# Altium schematic sheet DAC_and_amp.SchDoc
size A4; SheetNumber: 3; SheetTotal: 4
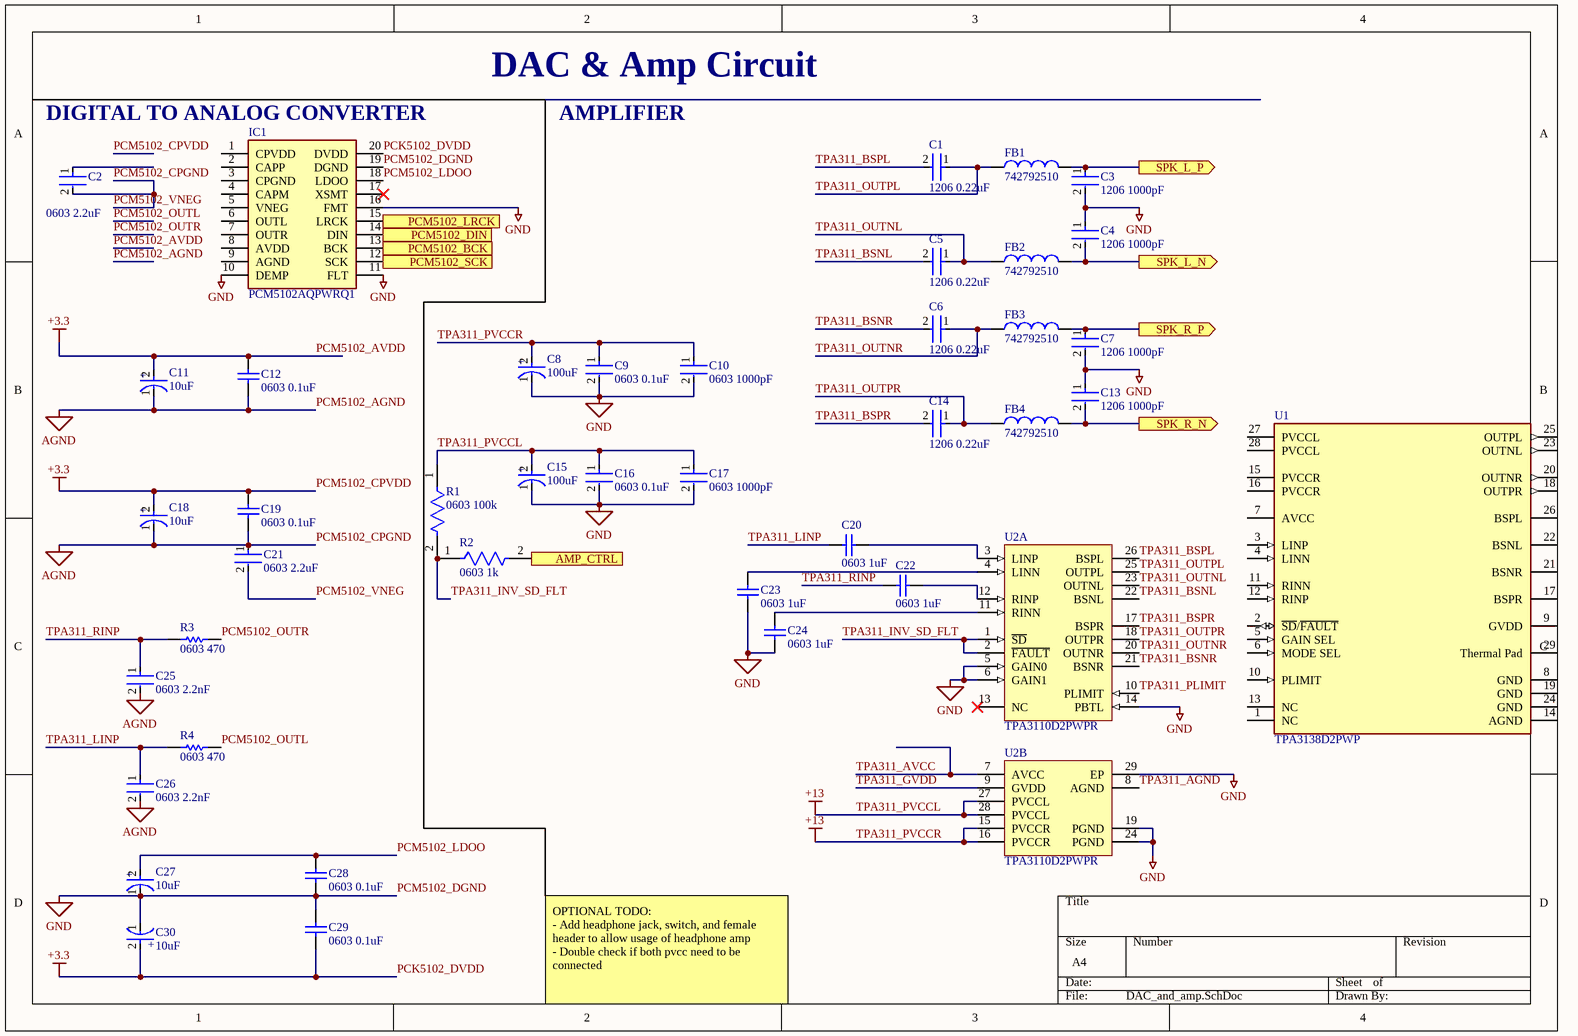
[diagram p0: DAC_and_amp.SchDoc]

## Parts
C1  1206 0.22uF  [FP-C1206C-EB-MFG]
C2  0603 2.2uF  [FP-GRM188-0_1-e0_2_0_5-MFG]
C3  1206 1000pF  [FP-C1206C-EB-MFG]
C4  1206 1000pF  [FP-C1206C-EB-MFG]
C5  1206 0.22uF  [FP-C1206C-EB-MFG]
C6  1206 0.22uF  [FP-C1206C-EB-MFG]
C7  1206 1000pF  [FP-C1206C-EB-MFG]
C8  100uF  [FP-RAD-TH-D_8_0_5-L_11_5-MFG]
C9  0603 0.1uF  [FP-C0603C-CF-MFG]
C10  0603 1000pF  [FP-C0603C-CF-MFG]
C11  10uF  [FP-35ZLH330MEFC10X12_5-MFG]
C12  0603 0.1uF  [CAPC1608X90X35ML10T15]
C13  1206 1000pF  [FP-C1206C-EB-MFG]
C14  1206 0.22uF  [FP-C1206C-EB-MFG]
C15  100uF  [FP-RAD-TH-D_8_0_5-L_11_5-MFG]
C16  0603 0.1uF  [FP-C0603C-CF-MFG]
C17  0603 1000pF  [FP-C0603C-CF-MFG]
C18  10uF  [FP-35ZLH330MEFC10X12_5-MFG]
C19  0603 0.1uF  [CAPC1608X90X35ML10T15]
C20  0603 1uF  [CAPC1608X87X35LL15T15]
C21  0603 2.2uF  [FP-GRM188-0_1-e0_2_0_5-MFG]
C22  0603 1uF  [CAPC1608X87X35LL15T15]
C23  0603 1uF  [CAPC1608X87X35LL15T15]
C24  0603 1uF  [CAPC1608X87X35LL15T15]
C25  0603 2.2nF  [FP-GRM188-0_1-e0_2_0_5-MFG]
C26  0603 2.2nF  [FP-GRM188-0_1-e0_2_0_5-MFG]
C27  10uF  [FP-35ZLH330MEFC10X12_5-MFG]
C28  0603 0.1uF  [CAPC1608X90X35ML10T15]
C29  0603 0.1uF  [CAPC1608X90X35ML10T15]
C30  10uF  [FP-35ZLH330MEFC10X12_5-MFG]
FB1  742792510  [WE-CBF_1812_L4.5W3.2H1.5_HC]
FB2  742792510  [WE-CBF_1812_L4.5W3.2H1.5_HC]
FB3  742792510  [WE-CBF_1812_L4.5W3.2H1.5_HC]
FB4  742792510  [WE-CBF_1812_L4.5W3.2H1.5_HC]
IC1  PCM5102AQPWRQ1  [SOP65P640X120-20N]
R1  0603 100k  [FP-RC0603-0_55-MFG]
R2  0603 1k  [FP-AC0603-IPC_B]
R3  0603 470  [RESC1608X55X30NL15T15]
R4  0603 470  [RESC1608X55X30NL15T15]
U1  TPA3138D2PWP  [FP-PWP0028H-IPC_B]
U2  TPA3110D2PWPR  [TI-PWP28-5720X1950TP_L]  (parts A,B of 2)

## Ports
AMP_CTRL, PCM5102_BCK, PCM5102_DIN, PCM5102_LRCK, PCM5102_SCK, SPK_L_N (out), SPK_L_P (out), SPK_R_N (out), SPK_R_P (out)

## Nets
PCK5102_DVDD: C11.2(A) C12.2 C18.2(A) C19.2 C29.1 C30.2(A) IC1.20(DVDD)  [also labelled +3.3, PCM5102_AVDD, PCM5102_CPVDD]
PCM5102_AGND: C2.2 C11.1(C) C12.1 C18.1(C) C19.1 C21.1 C21.2 C25.2 C26.2  [also labelled AGND, PCM5102_CPGND, PCM5102_VNEG]
PCM5102_DGND: C3.2 C4.1 C7.2 C8.1(C) C9.2 C10.2 C13.1 C15.1(C) C16.2 C17.2 C23.1 C24.1 C27.1(C) C28.1 C29.2 C30.1(C) IC1.10(DEMP) IC1.11(FLT) IC1.16(FMT) IC1.19(DGND) U2.5(GAIN0) U2.6(GAIN1) U2.14(PBTL) U2.19(PGND) U2.24(PGND) U2.29(EP)  [also labelled GND]
TPA311_PVCCL: C8.2(A) C9.1 C10.1 C15.2(A) C16.1 C17.1 R1.1 U2.15(PVCCR) U2.16(PVCCR) U2.27(PVCCL) U2.28(PVCCL)  [also labelled +13, TPA311_PVCCR]
AMP_CTRL: R2.2 ; port AMP_CTRL
PCM5102_BCK: IC1.13(BCK) ; port PCM5102_BCK
PCM5102_DIN: IC1.14(DIN) ; port PCM5102_DIN
PCM5102_LDOO: C27.2(A) C28.2 IC1.18(LDOO)
PCM5102_LRCK: IC1.15(LRCK) ; port PCM5102_LRCK
PCM5102_OUTL: R4.2
PCM5102_OUTR: R3.2
PCM5102_SCK: IC1.12(SCK) ; port PCM5102_SCK
SPK_L_N: C4.2 FB2.2 ; port SPK_L_N
SPK_L_P: C3.1 FB1.2 ; port SPK_L_P
SPK_R_N: C13.2 FB4.2 ; port SPK_R_N
SPK_R_P: C7.1 FB3.2 ; port SPK_R_P
TPA311_AGND: U2.8(AGND)
TPA311_AVCC: U2.7(AVCC)
TPA311_BSNL: C5.2 U2.22(BSNL)
TPA311_BSNR: C6.2 U2.21(BSNR)
TPA311_BSPL: C1.2 U2.26(BSPL)
TPA311_BSPR: C14.2 U2.17(BSPR)
TPA311_GVDD: U2.9(GVDD)
TPA311_INV_SD_FLT: R1.2 R2.1 U2.1(~{SD}) U2.2(~{FAULT})
TPA311_LINP: C20.1 C26.1 R4.1
TPA311_OUTNL: C5.1 FB2.1 U2.23(OUTNL)
TPA311_OUTNR: C6.1 FB3.1 U2.20(OUTNR)
TPA311_OUTPL: C1.1 FB1.1 U2.25(OUTPL)
TPA311_OUTPR: C14.1 FB4.1 U2.18(OUTPR)
TPA311_PLIMIT: U2.10(PLIMIT)
TPA311_RINP: C22.1 C25.1 R3.1
NetC20_2: C20.2 U2.3(LINP)
NetC22_2: C22.2 U2.12(RINP)
NetC23_2: C23.2 U2.4(LINN)
NetC24_2: C24.2 U2.11(RINN)

Not connected (* = marked no-connect by the designer): C2 1; IC1 1(CPVDD) 2(CAPP) 3(CPGND) 4(CAPM) 5(VNEG) 6(OUTL) 7(OUTR) 8(AVDD) 9(AGND) 17(XSMT)*; U1 1(NC) 2(~{SD}/~{FAULT}) 3(LINP) 4(LINN) 5(GAIN_SEL) 6(MODE_SEL) 7(AVCC) 8(GND) 9(GVDD) 10(PLIMIT) 11(RINN) 12(RINP) 13(NC) 14(AGND) 15(PVCCR) 16(PVCCR) 17(BSPR) 18(OUTPR) 19(GND) 20(OUTNR) 21(BSNR) 22(BSNL) 23(OUTNL) 24(GND) 25(OUTPL) 26(BSPL) 27(PVCCL) 28(PVCCL) 29(Thermal_Pad); U2 13(NC)*

## Notes on the sheet
- DAC & Amp Circuit
- (near IC1) DIGITAL TO ANALOG CONVERTER
- AMPLIFIER
- OPTIONAL TODO:
  - Add headphone jack, switch, and female header to allow usage of headphone amp
  - Double check if both pvcc need to be connected
- (in symbol CMP-01474-19941892-1) +
- (in symbol CMP-05427-002079-1) +

## Library data of the parts
C1 C5 C6 C14 = CMP-03020-014280-1: CAP CER 0.22UF 50V X7R 1206; Manufacturer Part Number: C1206C224K5RACTU; Manufacturer: KEMET; Value: 0.22 μF; Automotive Grade: Grade 0; Tolerance: 0.1; Material: Ceramic; Temperature Coefficient: 15%; Octopart: https://octopart.com/c1206c224k5ractu-kemet-99129; Automotive: Yes; ComponentLink2URL: https://content.kemet.com/datasheets/KEM_C1007_X8R_ULTRA_150C_SMD.pdf; Ipc Land Pattern Name: CAPC320160X78; Digikey Description: CAP CER 0.22UF 50V X7R 1206; Voltage Rating: 50 V; RoHS: TRUE; Device Class L3: Ceramic Capacitors; Device Class L2: Capacitors; Device Class L1: Passive Components; Temperature Range Low: -55°C; Temperature: -55°C to +150°C; Temperature Range High: +150°C; ComponentLink2Description: Datasheet; Category: Cap; Height: 0.88mm; Capacitance: 0.22 μF; Temperature Characteristic: X7R; Package: C1206C-EB; Lead Free: Yes
C2 C21 = CMP-2006-02836-2: Chip Multilayer Ceramic Capacitors for General Purpose, 0603, 2.2uF, X7R, 15%, 10%, 10V; Case Code (Metric): 1608; Height: 0.8mm; Packaging: Cut Tape; Voltage: 10V; Lead Free: Lead Free; Min Operating Temperature: -55°C; Voltage Rating (DC): 10V; Max Operating Temperature: 125°C; Voltage Rating: 10V; Dielectric: X7R; Depth: 0.8mm; Case Code (Imperial): 0603; Termination: SMD/SMT; Case/Package: 0603; Number of Pins: 2; REACH SVHC: No SVHC; Mount: Surface Mount; Width: 0.031inch; Material: Ceramic; Capacitance: 2.2uF; Package Quantity: 1; Weight: 7.1E-05oz; Length: 1.6mm; Thickness: 0.035inch; Tolerance: 10%
C3 C4 C7 C13 = CMP-03020-011698-1: CAP CER 100PF 100V C0G/NP0 1206; Manufacturer: KEMET; Manufacturer Part Number: C1206C101J1GACTU; Temperature Characteristic: C0G; Temperature Coefficient: 15%; Tolerance: 0.05; Automotive Grade: Grade 0; Material: Ceramic; Temperature Range Low: -55°C; Device Class L3: Ceramic Capacitors; Temperature: -55°C to +150°C; Value: 100 pF; Capacitance: 100 pF; ComponentLink2URL: https://content.kemet.com/datasheets/KEM_C1007_X8R_ULTRA_150C_SMD.pdf; Ipc Land Pattern Name: CAPC320160X78; Mouser Description: Multilayer Ceramic Capacitors MLCC - SMD/SMT 100volts 100pF C0G 5%; Automotive: Yes; Voltage Rating: 100 V; Octopart: https://octopart.com/c1206c101j1gactu-kemet-98729; Height: 0.88mm; RoHS: TRUE; Lead Free: Yes; Device Class L1: Passive Components; Package: C1206C-EB; Digikey Description: CAP CER 100PF 100V C0G/NP0 1206; ComponentLink2Description: Datasheet; Temperature Range High: +150°C; Category: Cap; Device Class L2: Capacitors
C8 C15 = CMP-05427-002079-1: Aluminum Electrolytic Capacitors (Radial Lead Type) 100uF ±20% 50V; ESR (Equivalent Series Resistance): 61mR; Lead Diameter: 0.6mm; Ripple Current (AC): 870mA; Life (Hours): 6000Hour; Lead/Base Style: Straight; Height - Seated (Max): 0.512inch; Height: 11.5mm; REACH SVHC: No SVHC; Contact Plating: Tin; Impedance: 61mR; Capacitance: 100uF; Voltage: 50V; Termination: Radial; Series: FR; Voltage Rating: 50V; Lead Pitch: 3.5mm; Diameter: 8mm; Number of Pins: 2; Min Operating Temperature: -40°C; Mount: Through Hole; Ripple Current: 870mA; Radiation Hardening: No; Length: 11.5mm; Max Operating Temperature: 105°C; Construction: RADIAL; Packaging: Bulk; Package Quantity: 200; Case/Package: Radial; RoHS Compliant: Yes; Voltage Rating (DC): 50V; Tolerance: 20%
C9 C16 = CMP-2006-03057-2: CAP CER 0.1UF 25V X7R 0603; Manufacturer Part Number: C0603C104K3RACTU; Manufacturer: KEMET; Description: C0603 0.10 μF X7R 30ppm/°C 10.00% 25 V; Value: 0.10 μF; Material: Ceramic; Tolerance: 0.1; Temperature Coefficient: 30ppm/°C; Automotive Grade: Grade 1; Lead Free: Yes; Device Class L3: Ceramic Capacitors; Voltage Rating: 25 V; Digikey Description: CAP CER 0.1UF 25V X7R 0603; Mouser Description: Multilayer Ceramic Capacitors MLCC - SMD/SMT 25volts 0.1uF X7R 10%; Package: C0603C-CF; Temperature Range Low: -55°C; Automotive: Yes; Device Class L2: Capacitors; Octopart: https://octopart.com/c0603c104k3ractu-kemet-127541; ComponentLink2Description: Datasheet; ComponentLink2URL: https://api.kemet.com/component-edge/download/datasheet/C0603C100J5GACAUTO.pdf; Temperature Range High: +125°C; RoHS: TRUE; Device Class L1: Passive Components; Category: Cap; Temperature: -55°C to +125°C; Capacitance: 0.10 μF; Height: 0.87mm; Temperature Characteristic: X7R
C10 C17 = CMP-2006-03010-2: CAP CER 1000PF 25V 5% NP0 0603; Manufacturer: KEMET; Manufacturer Part Number: C0603C102J3GACTU; Value: 1,000 pF; Description: C0603 1,000 pF C0G 30ppm/°C 5.00% 25 V; Tolerance: 0.05; Temperature Characteristic: C0G; Temperature Coefficient: 30ppm/°C; Automotive Grade: Grade 1; Material: Ceramic; Category: Cap; Device Class L2: Capacitors; Octopart: https://octopart.com/c0603c102j3gactu-kemet-8375722; Capacitance: 1,000 pF; ComponentLink2URL: https://api.kemet.com/component-edge/download/datasheet/C0603C100J5GACAUTO.pdf; Digikey Description: CAP CER 1000PF 25V 5% NP0 0603; Device Class L3: Ceramic Capacitors; Temperature Range Low: -55°C; Automotive: Yes; RoHS: TRUE; Temperature Range High: +125°C; ComponentLink2Description: Datasheet; Mouser Description: Multilayer Ceramic Capacitors MLCC - SMD/SMT 25volts 1000pF C0G 5%; Lead Free: Yes; Height: 0.87mm; Voltage Rating: 25 V; Temperature: -55°C to +125°C; Device Class L1: Passive Components; Package: C0603C-CF
C11 C18 C27 C30 = CMP-01474-19941892-1: 35ZLH330MEFC10X12.5 Radial Can ALUMINUM ELECTROLYTIC CAPACITOR ZLH 35V 330muF ±20% 0.394Dia 10.00mm; Life (Hours): 10000hours; Ripple Current: 1.33A; Lead Diameter: 600µm; Dissipation Factor: 12%; Impedance: 39mΩ; Leakage Current: 3µA; Capacitance: 330µF; Dielectric Material: Aluminium; Voltage Rating (AC): 35V; Radiation Hardening: No; Voltage Rating: 35V; Min Operating Temperature: -40°C; Lead Pitch: 5mm; REACH SVHC: No SVHC; Max Operating Temperature: 105°C; Tolerance: 20%; Features: General Purpose; Diameter: 10mm; Schedule B: 8532220020; Height: 12.5mm; Ripple Current (AC): 1.33A; Number of Pins: 2; Lead Free: Lead Free; RoHS: Compliant; Mount: Through Hole; NexarPartId: 19941892; Voltage Rating (DC): 35V; ESR (Equivalent Series Resistance): 39mΩ; Termination: Radial; Voltage: 35V; Height - Seated (Max): 13.9954mm; Case/Package: Radial
C12 C19 C28 C29 = CMP-2100-03643-1: Chip Capacitor, 0.1 uF, +/- 10%, 50 V, -55 to 125 degC, 0603 (1608 Metric), RoHS, Tape and Reel; Manufacturer: Murata; Dielectric Material: Ceramic; Voltage Rating: 50V; Capacitance: 100nF; Dielectric: X7R; Insulation Resistance: 10GR; Case Code (Metric): 1608; Lead Free: LeadFree; Depth: 0.8mm; Number of Pins: 2; Radiation Hardening: No; Case/Package: 0603; Manufacturer URL: http://www.murata.com/; Packaging: TapeandReel; Length: 1.6mm; Contact Plating: Tin; Datasheet URL: http://psearch.en.murata.com/capacitor/product/GRM188R71H104KA93%23.pdf; Tolerance: 10%; Case Code (Imperial): 0603; Min Operating Temperature: -55degC; RoHSCompliant: true; Voltage: 50V; Termination: SMD/SMT; Mount: SurfaceMount; Material: Ceramic; Package Quantity: 1; Height: 0.8mm; Thickness: 0.035inch; REACH SVHC: NoSVHC; Max Operating Temperature: 125degC; Width: 0.8mm; Package Reference: 0603; Voltage Rating (DC): 50V; Datasheet Version: 42675.0; Package Description: 2-Pin Surface Mount Device, Body 1.6 x 0.8 mm
C20 C22-C24 = CMP-2006-03713-1: Part Number: C0603C105K3RACTU; Manufacturer: Kemet
C25 C26 = CMP-06035-056041-1: Chip Multilayer Ceramic Capacitors for General Purpose, 0603, 2200pF, C0G, 30ppm/°C, 5%, 50V; Insulation Resistance: 10GR; Min Operating Temperature: -55°C; Voltage: 50V; Tolerance: 5%; Height: 0.8mm; Packaging: Tape and Reel; Length: 1.6mm; Mount: Surface Mount; Temperature Coefficient: 30ppm/°C; Case Code (Metric): 1608; Case/Package: 0603; Lead Free: Lead Free; Voltage Rating: 50V; Termination: SMD/SMT; Max Operating Temperature: 125°C; Voltage Rating (DC): 50V; Number of Pins: 2; Dielectric: C0G; Material: Ceramic; Thickness: 0.035inch; REACH SVHC: No SVHC; Dielectric Material: Ceramic; Case Code (Imperial): 0603; Radiation Hardening: No; Package Quantity: 1; Capacitance: 2.2nF; Width: 0.8mm; Depth: 0.8mm
FB1-FB4 = CMP-0220-00085-2: NexarPartId: 7861697; Impedance: 70Ω; Resistance: 30mΩ; Max DC Current: 3mA; Max Current Rating: 6A; Number of Lines: 1; Test Frequency: 100MHz; Tolerance: 25%; Case Code (Metric): 4532; RoHS: Compliant; Lead Free: Lead Free; Height: 1.5mm; REACH SVHC: Unknown; Case Code (Imperial): 1812; Length: 4.5mm; Min Operating Temperature: -55°C; Width: 3.2mm; Max Operating Temperature: 125°C; Depth: 3.2mm; Termination: SMD/SMT; Material: Ferrite; Packaging: Cut Tape (CT); DC Resistance (DCR): 30mΩ; Current Rating: 6A; Case/Package: SMD/SMT; Weight: 112.008966mg; Mount: Surface Mount
IC1 = PCM5102AQPWRQ1: Integrated Circuit; Manufacturer_Name: Texas Instruments; Datasheet Link: http://www.ti.com/lit/gpn/pcm5102a-q1; Height: 1.2mm; Manufacturer_Part_Number: PCM5102AQPWRQ1; Mouser Part Number: 595-PCM5102AQPWRQ1; Mouser Price/Stock: https://www.mouser.co.uk/ProductDetail/Texas-Instruments/PCM5102AQPWRQ1?qs=wqe5ZXqX%252B9%252B9Oa8bkTy%252BXw%3D%3D; Arrow Part Number: PCM5102AQPWRQ1; Arrow Price/Stock: https://www.arrow.com/en/products/pcm5102aqpwrq1/texas-instruments?utm_currency=USD&region=nac
R1 = CMP-2100-03662-2: RES SMD 100K OHM 1% 1/10W 0603; Voltage Rating (DC): 50V; Resistance: 100kR; Max Power Dissipation: 100mW; Temperature Coefficient: 100ppm/°C; Working Voltage: 75V; Length: 1.6mm; Lead Free: Lead Free; Number of Terminations: 2; Packaging: Tape and Reel; Voltage Rating: 50V; Termination: SMD/SMT; Width: 0.8mm; Resistor Type: Thick Film; Resistance Tolerance: 1%; Features: Moisture Resistant; Height: 0.45mm; Construction: Rectangular; Case/Package: 0603; Military Standard: Not; Case Code (Imperial): 0603; Series: RC; Technology: THICK FILM; Depth: 0.8mm; RoHS Compliant: Yes; REACH SVHC: No SVHC; Min Operating Temperature: -55°C; Case Code (Metric): 1608; Max Operating Temperature: 155°C; Power Rating: 100mW; Number of Pins: 2; Tolerance: 1%
R2 = CMP-2000-04828-3: RES 1kΩ 1.00% 0.1W 0603; Voltage Rating: 50V; Power Rating: 100mW; Tolerance: 1%; Temperature Coefficient: 100ppm/°C; Resistance: 1kR; Depth: 0.8mm; Case/Package: 0603; Size Code: 0603; Case Code (Metric): 1608; Height: 0.022inch; Series: AC; Width: 0.031inch; Construction: Rectangular; Length: 0.063inch; Case Code (Imperial): 0603; Package Quantity: 1; RoHS Compliant: Yes; Features: Moisture Resistant; Resistor Type: Thick Film; Max Power Dissipation: 100mW; Packaging: Tape and Reel; Termination: SMD/SMT; Ratings: AEC-Q200; Max Operating Temperature: 155°C; Min Operating Temperature: -55°C; Military Standard: Not; Lead Free: Lead Free; Number of Terminations: 2
R3 R4 = CMP-2000-00795-1: Part Number: ERJ-3GEYJ471V; Manufacturer: Panasonic
U1 = CMP-04894-000049-1: IC AMP D MON/STER 18.5W 28HTSSOP; Min Operating Temperature: -40°C; Max Operating Temperature: 85°C; RoHS Compliant: Yes
U2 = CMP-0994-00255-1: 15 W Filter-Free Class D Stereo Amplifier with SpeakerGuard(TM), -40 to 85 degC, 28-pin SOP (PWP28), Green (RoHS & no Sb/Br); Manufacturer: Texas Instruments; Power Stage Supply Min(V): 8; Analog Supply Max [V]: 26; Input Type: Analog; Max. Number of Speaker Outputs: 2; SubFamily: Mid/High-Power Amplifier; PackageReference: PWP28-5720X1950TP; Analog Supply Min [V]: 8; ComponentLink1URL: http://www.ti.com/; ComponentLink1Description: Manufacturer URL; PartNumber: TPA3110D2PWPR; PackageDescription: 28-Pin Plastic Small Outline, Body 4.4 x 9.7 mm, Pitch 0.65 mm; PackageVersion: 4073225-6/I, 05/2011; Mounting Technology: Surface Mount; ComponentLink2URL: http://www.ti.com/general/docs/lit/getliterature.tsp?genericPartNumber=TPA3110D2&fileType=pdf; ComponentLink2Description: Datasheet; ComponentLink3URL: http://www.ti.com/litv/pdf/mpds373; Eco-Plan: Green (RoHS & no Sb/Br); Code_JEDEC: MO-153; ComponentLink3Description: Package Specification; DatasheetVersion: SLOS528D